# EAGLE design SensorShield (EAGLE 9.3.0)
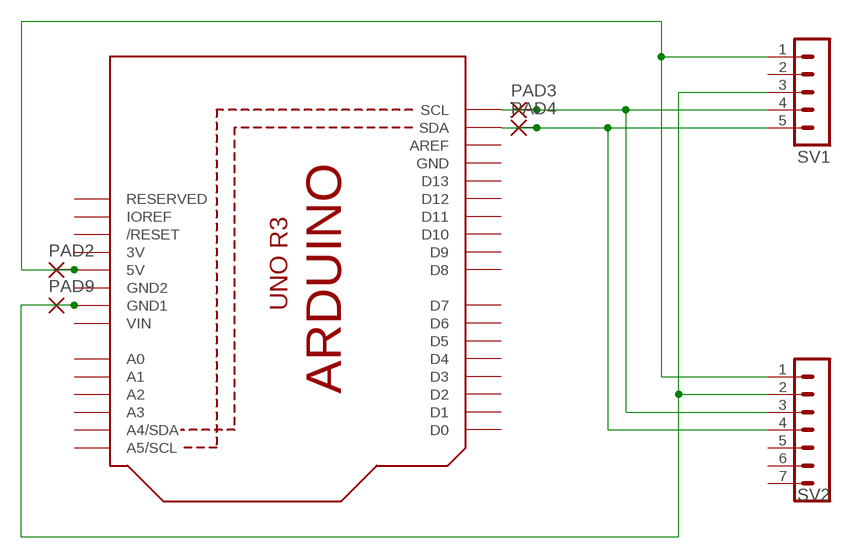
[diagram p0: schematic, sheet 1]

## Parts
PAD2  1,6/0,8  [1,6/0,8]
PAD3  1,6/0,8  [1,6/0,8]
PAD4  1,6/0,8  [1,6/0,8]
PAD9  1,6/0,8  [1,6/0,8]
SV1  MA05-1  [MA05-1]
SV2  MA07-1  [MA07-1]
U1  ARDUINOR3-BPLACE  [ARDUINOR3-BPLACE]

## Nets
N$1: PAD9.1(P) SV1.3 SV2.2 U1.GND1
N$2: PAD3.1(P) SV1.4 SV2.3 U1.SCL
N$3: PAD4.1(P) SV1.5 SV2.4 U1.SDA
N$15: PAD2.1(P) SV1.1 SV2.1 U1.5V
Unconnected: SV1.2 SV2.5 SV2.6 SV2.7 U1.A0 U1.A1 U1.A2 U1.A3 U1.A4(A4/SDA) U1.A5(A5/SCL) U1.AREF U1.D0 U1.D1 U1.D2 U1.D3 U1.D4 U1.D5 U1.D6 U1.D7 U1.D8 U1.D9 U1.D10 U1.D11 U1.D12 U1.D13 U1.IOREF U1.RESERVED U1.RESET(/RESET)

## Power pins joined to a net without a drawn wire
3V: U1.3V
GND: U1.GND
GND2: U1.GND2
VIN: U1.VIN

## Library data of the parts
PAD2-PAD4 PAD9 = wirepad:1,6/0,8: THROUGH-HOLE PAD
SV1 = con-lstb:MA05-1: PIN HEADER; OC_FARNELL: unknown; OC_NEWARK: unknown
SV2 = con-lstb:MA07-1: PIN HEADER; OC_FARNELL: unknown; OC_NEWARK: unknown
U1 = adafruit:ARDUINOR3: This is a new object for the new Arduino R3 - with extra pins that you may want to use (such as IOref, and duplicated A4/A5

## Board
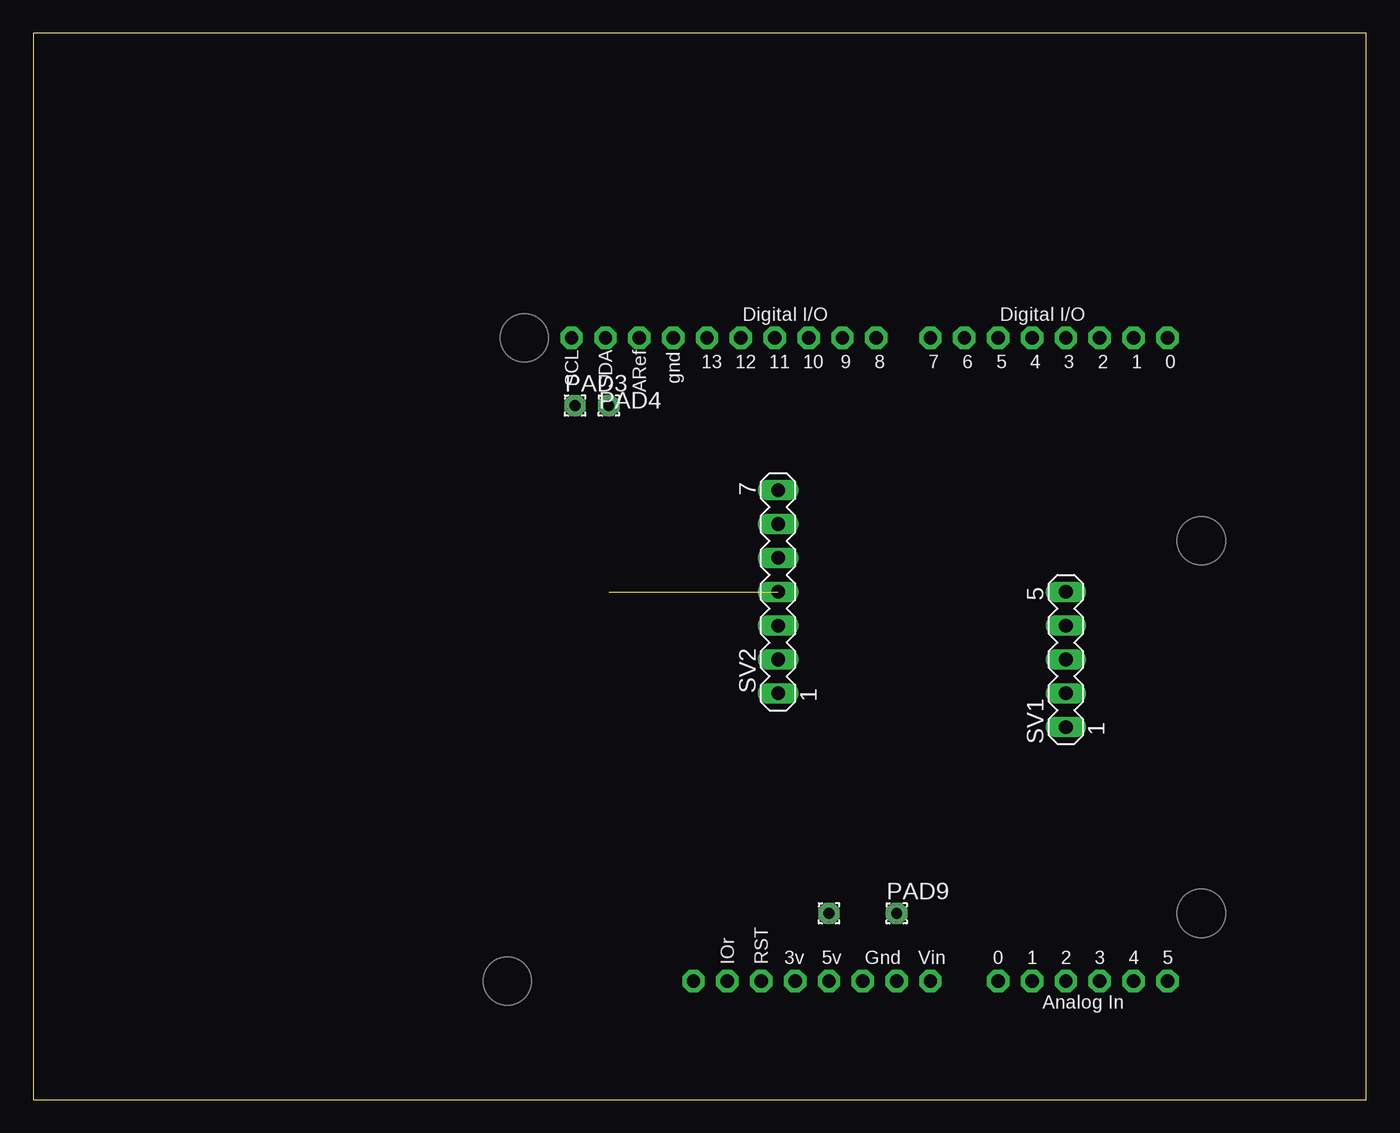
[diagram p1: board, top side]
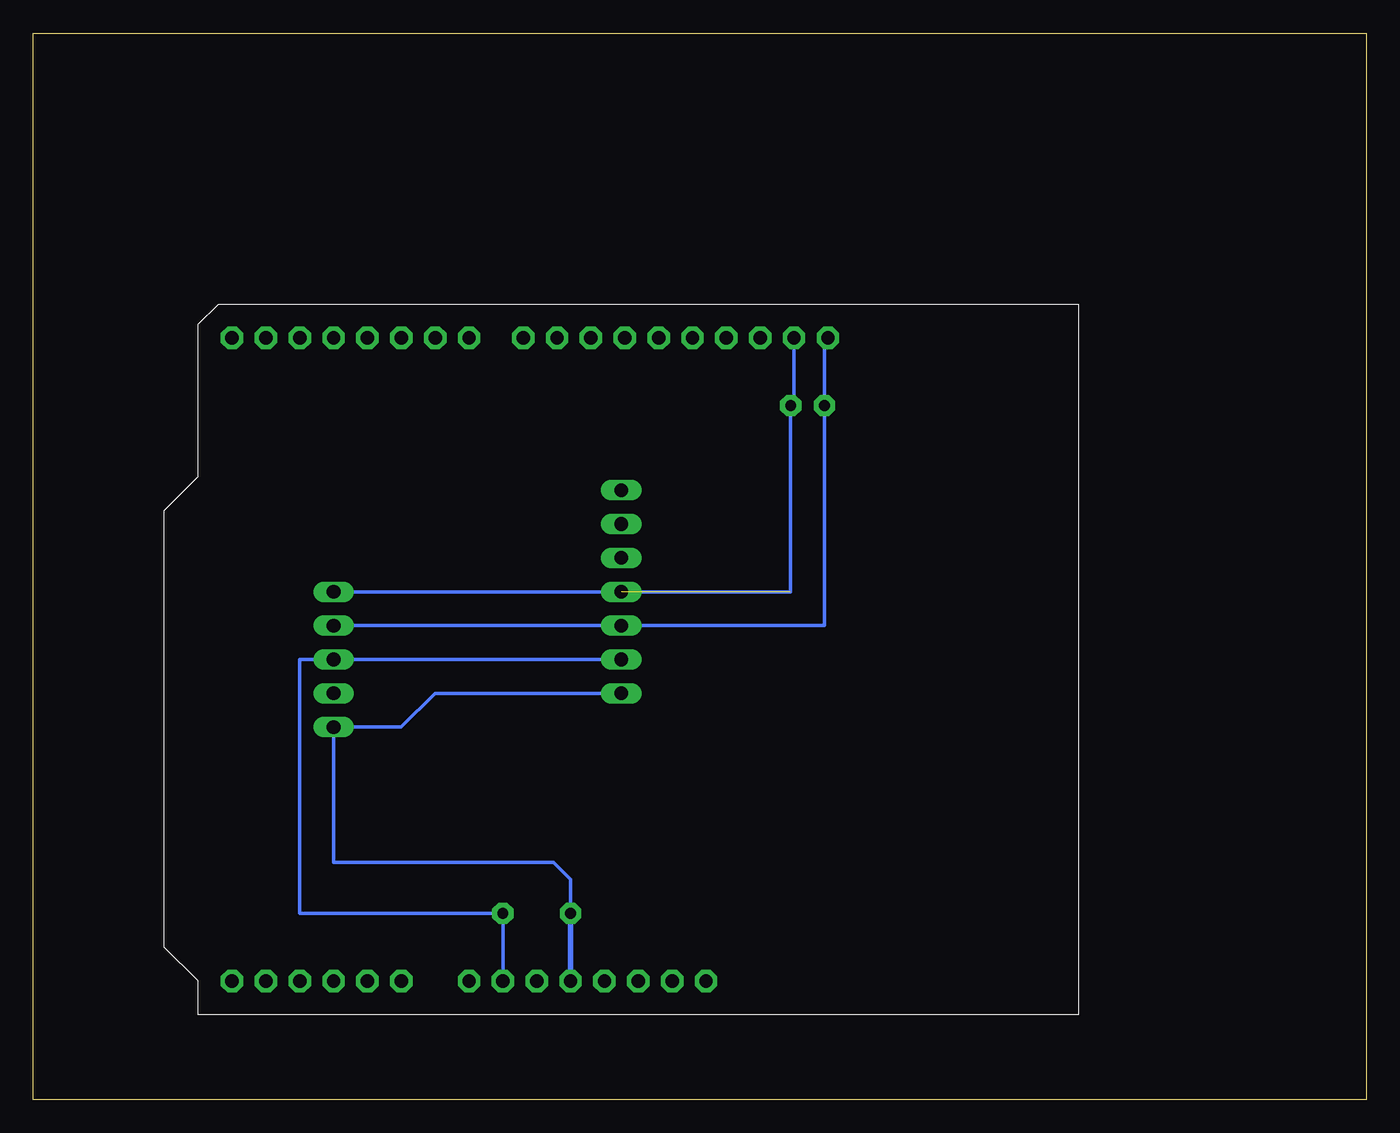
[diagram p2: board, bottom side, seen from below]

Size 100 x 80 mm. Coordinates in mm from the lower left corner, seen from the top.
Outline: 0,0 100,0 100,80 0,80 0,0
Copper layers (1*16): Top 0.035mm / dielectric 1.5mm / Bottom 0.035mm
Design rules "default": minimum track width 10mil, minimum drill 24mil, track to track 8mil, track to pad 8mil, pad to pad 8mil, via to via 8mil, smd to smd 8mil, copper to edge 40mil, drill to drill 8mil, minimum pad ring 10mil, minimum via ring 8mil, stop-mask expansion 4mil, vias tented up to drill 0mil, thermal gap 10mil

### Footprints (pad centres in the part's own frame; a part is rotated, then mirrored left to right if it is on the bottom)
1,6/0,8 = drill 0.813 pad 1.6 octagon: 1 0,0
MA05-1 = drill 1.016 long: 1 -5.08,0; 2 -2.54,0; 3 0,0; 4 2.54,0; 5 5.08,0
MA07-1 = drill 1.016 long: 1 -7.62,0; 2 -5.08,0; 3 -2.54,0; 4 0,0; 5 2.54,0; 6 5.08,0; 7 7.62,0
ARDUINOR3-BPLACE = drill 1 pad 1.676 octagon: 3V 35.56,2.54; 5V 38.1,2.54; A0 50.8,2.54; A1 53.34,2.54; A2 55.88,2.54; A3 58.42,2.54; A4 60.96,2.54; A5 63.5,2.54; AREF 23.876,50.8; D0 63.5,50.8; D1 60.96,50.8; D2 58.42,50.8; D3 55.88,50.8; D4 53.34,50.8; D5 50.8,50.8; D6 48.26,50.8; D7 45.72,50.8; D8 41.656,50.8; D9 39.116,50.8; D10 36.576,50.8; D11 34.036,50.8; D12 31.496,50.8; D13 28.956,50.8; GND 26.416,50.8; GND1 43.18,2.54; GND2 40.64,2.54; IOREF 30.48,2.54; RESERVED 27.94,2.54; RESET 33.02,2.54; SCL 18.796,50.8; SDA 21.336,50.8; VIN 45.72,2.54

### Placement (x,y rotation side)
PAD2  59.69,13.97 0 top
PAD3  40.64,52.07 0 top
PAD4  43.18,52.07 0 top
PAD9  64.77,13.97 0 top
SV1  77.47,33.02 90 top
SV2  55.88,38.1 90 top
U1  21.59,6.35 0 top

### Tracks (layer width: path | path; a pad name or v marks a point on that pad's centre or on a via)
N$1
  Bottom 0.254: SV2.2 SV1.3 80.01,33.02 80.01,13.97 PAD9.1 U1.GND1
N$2
  Bottom 0.254: SV1.4 SV2.3 40.64,35.56 PAD3.1 40.64,56.9 U1.SCL
N$3  (1 unrouted)
  Bottom 0.254: U1.SDA 42.93,52.32 PAD4.1 43.18,38.1 SV1.5
N$15
  Bottom 0.254: SV2.1 69.85,30.48 72.39,27.94 SV1.1 77.47,17.78 60.96,17.78 59.69,16.51 PAD2.1
  Bottom 0.406: 59.69,12.76 U1.5V PAD2.1